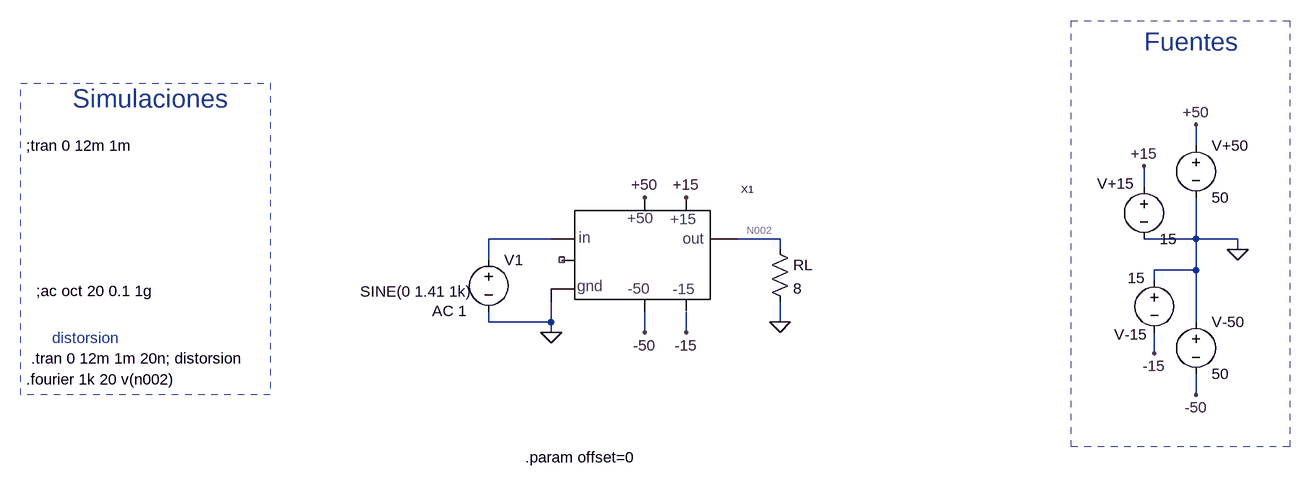
[diagram p0: schematic ampli-v2.asc]
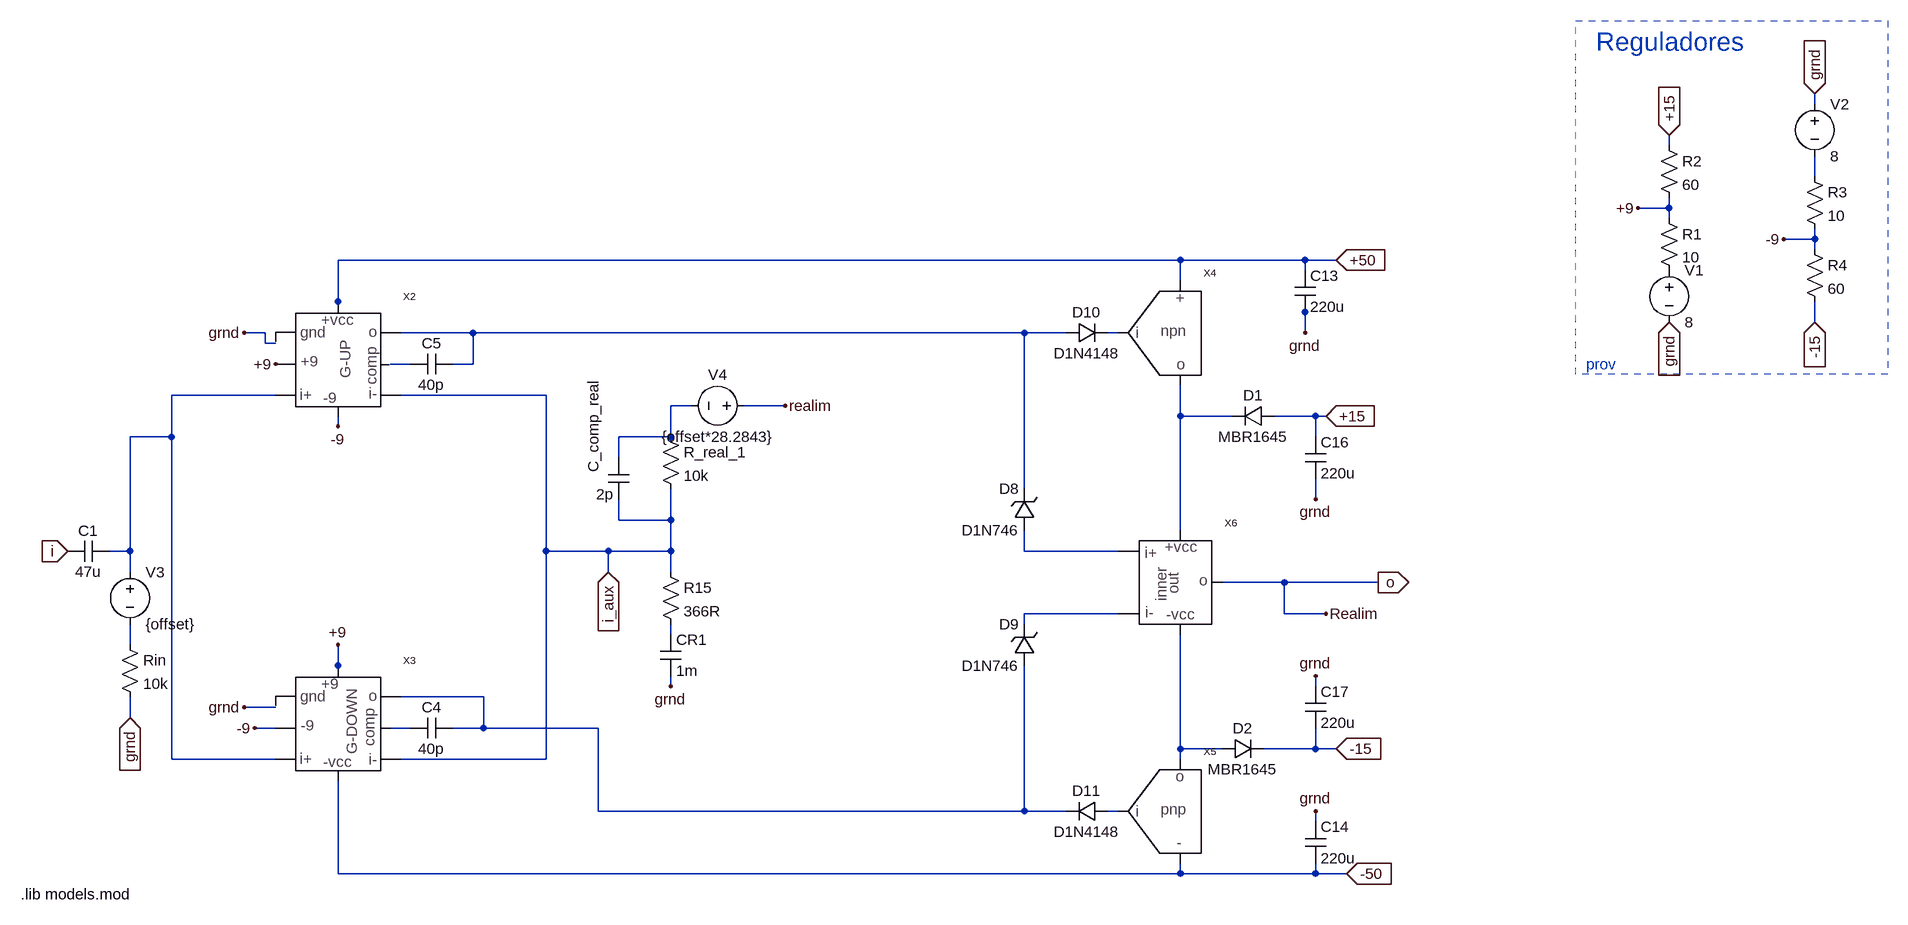
[diagram p1: sub-circuit ss-ampli-v2.asc]
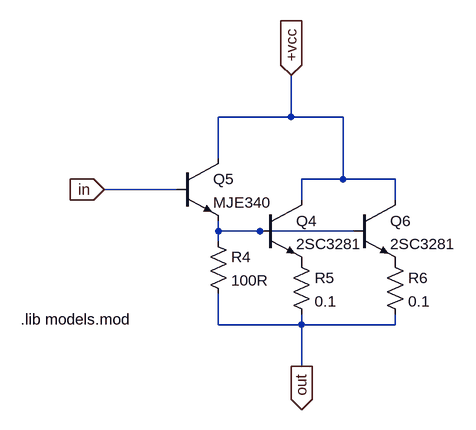
[diagram p2: sub-circuit ss-trans-out-npn.asc]
ampli-v2.asc, the LTspice schematic file:
Version 4
SHEET 1 1188 680
WIRE 1040 -32 1040 -64
WIRE 960 32 960 0
WIRE 48 112 -48 112
WIRE 400 112 336 112
WIRE 1040 112 1040 48
WIRE 1040 112 960 112
WIRE 1104 112 1040 112
WIRE 400 128 400 112
WIRE 1104 128 1104 112
WIRE -48 144 -48 112
WIRE 1040 160 1040 112
WIRE 1040 160 976 160
WIRE 976 176 976 160
WIRE -48 240 -48 224
WIRE 48 240 48 208
WIRE 48 240 -48 240
WIRE 400 240 400 208
WIRE 1040 240 1040 160
WIRE 48 256 48 240
WIRE 192 256 192 224
WIRE 256 256 256 224
WIRE 976 288 976 256
WIRE 1040 352 1040 320
FLAG 1104 128 0
FLAG 400 240 0
FLAG 1040 -64 +50
FLAG 960 0 +15
FLAG 976 288 -15
FLAG 1040 352 -50
FLAG 192 48 +50
FLAG 256 48 +15
FLAG 192 256 -50
FLAG 256 256 -15
FLAG 48 256 0
SYMBOL rui\\shortcuts\\voltage 976 160 R0
WINDOW 0 -62 99 Left 2
WINDOW 3 -41 12 Left 2
WINDOW 123 0 0 Left 2
WINDOW 39 0 0 Left 2
SYMATTR InstName V-15
SYMATTR Value 15
SYMBOL rui\\shortcuts\\voltage 1040 -48 R0
SYMATTR InstName V+50
SYMATTR Value 50
SYMBOL rui\\shortcuts\\voltage 960 16 R0
WINDOW 0 -72 11 Left 2
SYMATTR InstName V+15
SYMATTR Value 15
SYMBOL rui\\shortcuts\\voltage -48 128 R0
WINDOW 3 -198 65 Left 2
WINDOW 123 -87 95 Left 2
WINDOW 39 0 0 Left 2
SYMATTR Value SINE(0 1.41 1k)
SYMATTR Value2 AC 1
SYMATTR InstName V1
SYMBOL res 384 112 R0
SYMATTR InstName RL
SYMATTR Value 8
SYMBOL rui\\shortcuts\\voltage 1040 224 R0
SYMATTR InstName V-50
SYMATTR Value 50
SYMBOL ss-ampli-v2 192 128 R0
SYMATTR InstName X1
TEXT -760 -32 Left 2 !;tran 0 12m 1m
TEXT -760 328 Left 2 !.fourier 1k 20 v(n002)
TEXT 960 -192 Left 4 ;Fuentes
TEXT -688 -104 Left 4 ;Simulaciones
TEXT -752 296 Left 2 !.tran 0 12m 1m 20n; distorsion
TEXT -720 264 Left 2 ;distorsion
TEXT -744 192 Left 2 !;ac oct 20 0.1 1g
TEXT 8 448 Left 2 !.param offset=0
RECTANGLE Normal 1184 432 848 -224 2
RECTANGLE Normal -384 352 -768 -128 2

ss-ampli-v2.asc, the sub-circuit schematic file:
Version 4
SHEET 1 5420 680
WIRE 2896 -1552 2896 -1568
WIRE 2672 -1488 2672 -1504
WIRE 2896 -1440 2896 -1472
WIRE 2672 -1392 2672 -1408
WIRE 2672 -1392 2624 -1392
WIRE 2672 -1376 2672 -1392
WIRE 2896 -1344 2896 -1360
WIRE 2896 -1344 2848 -1344
WIRE 2896 -1328 2896 -1344
WIRE 1920 -1312 624 -1312
WIRE 2112 -1312 1920 -1312
WIRE 2160 -1312 2112 -1312
WIRE 2112 -1296 2112 -1312
WIRE 1920 -1280 1920 -1312
WIRE 624 -1248 624 -1312
WIRE 624 -1232 624 -1248
WIRE 2112 -1232 2112 -1248
WIRE 2896 -1216 2896 -1248
WIRE 512 -1200 480 -1200
WIRE 832 -1200 720 -1200
WIRE 1680 -1200 832 -1200
WIRE 1744 -1200 1680 -1200
WIRE 1824 -1200 1808 -1200
WIRE 2112 -1200 2112 -1232
WIRE 512 -1184 512 -1200
WIRE 528 -1184 512 -1184
WIRE 736 -1152 704 -1152
WIRE 832 -1152 832 -1200
WIRE 832 -1152 800 -1152
WIRE 528 -1104 368 -1104
WIRE 944 -1104 720 -1104
WIRE 1168 -1088 1136 -1088
WIRE 1312 -1088 1248 -1088
WIRE 1920 -1072 1920 -1120
WIRE 1936 -1072 1920 -1072
WIRE 2000 -1072 1936 -1072
WIRE 2096 -1072 2064 -1072
WIRE 2128 -1072 2096 -1072
WIRE 2144 -1072 2128 -1072
WIRE 624 -1056 624 -1072
WIRE 368 -1040 368 -1104
WIRE 368 -1040 304 -1040
WIRE 1136 -1040 1136 -1088
WIRE 1136 -1040 1056 -1040
WIRE 2128 -1040 2128 -1072
WIRE 1056 -1008 1056 -1040
WIRE 1680 -960 1680 -1200
WIRE 2128 -944 2128 -976
WIRE 1056 -912 1056 -944
WIRE 1136 -912 1136 -960
WIRE 1136 -912 1056 -912
WIRE 1920 -896 1920 -1072
WIRE 304 -864 304 -1040
WIRE 304 -864 272 -864
WIRE 944 -864 944 -1104
WIRE 1040 -864 944 -864
WIRE 1136 -864 1136 -912
WIRE 1136 -864 1040 -864
WIRE 1680 -864 1680 -896
WIRE 1824 -864 1680 -864
WIRE 304 -832 304 -864
WIRE 1040 -832 1040 -864
WIRE 1136 -832 1136 -864
WIRE 2080 -816 1984 -816
WIRE 2224 -816 2080 -816
WIRE 1824 -768 1680 -768
WIRE 2080 -768 2080 -816
WIRE 2144 -768 2080 -768
WIRE 1680 -752 1680 -768
WIRE 1136 -736 1136 -752
WIRE 304 -720 304 -752
WIRE 624 -688 624 -720
WIRE 624 -672 624 -688
WIRE 1136 -656 1136 -672
WIRE 2128 -656 2128 -672
WIRE 848 -640 720 -640
WIRE 528 -624 480 -624
WIRE 304 -608 304 -640
WIRE 528 -592 496 -592
WIRE 736 -592 704 -592
WIRE 848 -592 848 -640
WIRE 848 -592 800 -592
WIRE 1024 -592 848 -592
WIRE 1680 -576 1680 -688
WIRE 1920 -560 1920 -736
WIRE 1984 -560 1920 -560
WIRE 2080 -560 2048 -560
WIRE 2128 -560 2128 -592
WIRE 2128 -560 2080 -560
WIRE 2160 -560 2128 -560
WIRE 368 -544 368 -1040
WIRE 528 -544 368 -544
WIRE 944 -544 944 -864
WIRE 944 -544 720 -544
WIRE 1920 -544 1920 -560
WIRE 1024 -464 1024 -592
WIRE 1680 -464 1680 -576
WIRE 1680 -464 1024 -464
WIRE 1744 -464 1680 -464
WIRE 1824 -464 1808 -464
WIRE 2128 -448 2128 -464
WIRE 624 -368 624 -512
WIRE 1920 -368 1920 -384
WIRE 1920 -368 624 -368
WIRE 2128 -368 2128 -384
WIRE 2128 -368 1920 -368
WIRE 2176 -368 2128 -368
FLAG 2176 -368 -50
IOPIN 2176 -368 In
FLAG 2160 -560 -15
IOPIN 2160 -560 In
FLAG 2160 -1312 +50
IOPIN 2160 -1312 In
FLAG 2144 -1072 +15
IOPIN 2144 -1072 In
FLAG 1312 -1088 realim
FLAG 2144 -768 Realim
FLAG 208 -864 i
IOPIN 208 -864 In
FLAG 304 -608 grnd
IOPIN 304 -608 In
FLAG 2224 -816 o
IOPIN 2224 -816 Out
FLAG 1136 -656 grnd
FLAG 2128 -672 grnd
FLAG 2128 -944 grnd
FLAG 2112 -1200 grnd
FLAG 2128 -464 grnd
FLAG 1040 -832 i_aux
IOPIN 1040 -832 In
FLAG 624 -720 +9
FLAG 496 -592 -9
FLAG 624 -1056 -9
FLAG 528 -1152 +9
FLAG 2672 -1504 +15
IOPIN 2672 -1504 In
FLAG 2672 -1216 grnd
IOPIN 2672 -1216 In
FLAG 2624 -1392 +9
FLAG 2896 -1568 grnd
IOPIN 2896 -1568 In
FLAG 2848 -1344 -9
FLAG 2896 -1216 -15
IOPIN 2896 -1216 In
FLAG 480 -1200 grnd
FLAG 480 -624 grnd
DATAFLAG 1680 -576 "round($*100)/100"
DATAFLAG 2080 -816 "round($*10k)/10k"
DATAFLAG 2080 -560 "round($*100)/100"
DATAFLAG 2096 -1072 "round($*100)/100"
DATAFLAG 2096 -1072 "round($*100)/100"
DATAFLAG 2672 -1392 "round($*100)/100"
DATAFLAG 2896 -1344 "round($*100)/100"
DATAFLAG 1936 -1072 "round($*100)/100"
DATAFLAG 1936 -1072 "round($*100)/100"
SYMBOL diode 1744 -1184 R270
WINDOW 0 32 32 VTop 2
WINDOW 3 0 32 VBottom 2
SYMATTR InstName D10
SYMATTR Value D1N4148
SYMBOL zener 1696 -896 R180
WINDOW 0 24 64 Left 2
WINDOW 3 24 0 Left 2
SYMATTR InstName D8
SYMATTR Value D1N746
SYMBOL zener 1696 -688 R180
WINDOW 0 24 64 Left 2
WINDOW 3 24 0 Left 2
SYMATTR InstName D9
SYMATTR Value D1N746
SYMBOL diode 1808 -480 R90
WINDOW 0 0 32 VBottom 2
WINDOW 3 32 32 VTop 2
SYMATTR InstName D11
SYMATTR Value D1N4148
SYMBOL res 1120 -848 R0
SYMATTR InstName R15
SYMATTR Value 366R
SYMBOL res 1120 -1056 R0
SYMATTR InstName R_real_1
SYMATTR Value 10k
SYMBOL res 288 -736 R0
SYMATTR InstName Rin
SYMATTR Value 10k
SYMBOL cap 1120 -736 R0
SYMATTR InstName CR1
SYMATTR Value 1m
SYMBOL cap 272 -880 R90
WINDOW 0 0 32 VBottom 2
WINDOW 3 32 32 VTop 2
SYMATTR InstName C1
SYMATTR Value 47u
SYMBOL cap 2112 -448 R0
SYMATTR InstName C14
SYMATTR Value 220u
SYMBOL cap 2112 -1040 R0
SYMATTR InstName C16
SYMATTR Value 220u
SYMBOL cap 2112 -656 R0
SYMATTR InstName C17
SYMATTR Value 220u
SYMBOL cap 2096 -1296 R0
SYMATTR InstName C13
SYMATTR Value 220u
SYMBOL cap 1072 -944 R180
WINDOW 0 55 185 VLeft 2
WINDOW 3 24 8 Left 2
SYMATTR InstName C_comp_real
SYMATTR Value 2p
SYMBOL ss-trans-out-npn 1904 -1200 R0
SYMATTR InstName X4
SYMBOL ss-trans-out-pnp 1904 -464 R0
SYMATTR InstName X5
SYMBOL ss-inner-out 1920 -816 R0
SYMATTR InstName X6
SYMBOL rui\\shortcuts\\voltage 2672 -1312 R0
WINDOW 123 0 0 Left 2
WINDOW 39 0 0 Left 2
SYMATTR InstName V1
SYMATTR Value 8
SYMBOL res 2656 -1392 R0
SYMATTR InstName R1
SYMATTR Value 10
SYMBOL res 2656 -1504 R0
SYMATTR InstName R2
SYMATTR Value 60
SYMBOL rui\\shortcuts\\voltage 2896 -1568 R0
WINDOW 123 0 0 Left 2
WINDOW 39 0 0 Left 2
SYMATTR InstName V2
SYMATTR Value 8
SYMBOL res 2880 -1456 R0
SYMATTR InstName R3
SYMATTR Value 10
SYMBOL res 2880 -1344 R0
SYMATTR InstName R4
SYMATTR Value 60
SYMBOL ss-12+ 624 -1168 R0
SYMATTR InstName X2
SYMBOL ss-12- 624 -608 R0
SYMATTR InstName X3
SYMBOL rui\\shortcuts\\voltage 304 -848 R0
WINDOW 123 0 0 Left 2
WINDOW 39 0 0 Left 2
SYMATTR InstName V3
SYMATTR Value {offset}
SYMBOL rui\\shortcuts\\voltage 1264 -1088 R90
WINDOW 0 -32 56 VBottom 2
WINDOW 3 32 56 VTop 2
WINDOW 123 0 0 Left 2
WINDOW 39 0 0 Left 2
SYMATTR InstName V4
SYMATTR Value {offset*28.2843}
SYMBOL diode 2064 -1056 M270
WINDOW 0 32 32 VTop 2
WINDOW 3 0 32 VBottom 2
SYMATTR InstName D1
SYMATTR Value MBR1645
SYMBOL diode 1984 -544 R270
WINDOW 0 32 32 VTop 2
WINDOW 3 0 32 VBottom 2
SYMATTR InstName D2
SYMATTR Value MBR1645
SYMBOL cap 800 -608 R90
WINDOW 0 0 32 VBottom 2
WINDOW 3 32 32 VTop 2
SYMATTR InstName C4
SYMATTR Value 40p
SYMBOL cap 800 -1168 R90
WINDOW 0 0 32 VBottom 2
WINDOW 3 32 32 VTop 2
SYMATTR InstName C5
SYMATTR Value 40p
TEXT 136 -336 Left 2 !.lib models.mod
TEXT 2560 -1648 Left 4 ;Reguladores
TEXT 2544 -1152 Left 2 ;prov
RECTANGLE Normal 3008 -1136 2528 -1680 2

ss-trans-out-npn.asc, the sub-circuit schematic file:
Version 4
SHEET 1 880 680
WIRE 208 -64 208 -128
WIRE 208 -64 96 -64
WIRE 288 -64 208 -64
WIRE 96 0 96 -64
WIRE 288 32 288 -64
WIRE 288 32 224 32
WIRE 368 32 288 32
WIRE 32 48 -80 48
WIRE 224 64 224 32
WIRE 368 64 368 32
WIRE 96 112 96 96
WIRE 160 112 96 112
WIRE 304 112 160 112
WIRE 96 128 96 112
WIRE 96 256 96 208
WIRE 224 256 224 240
WIRE 224 256 96 256
WIRE 320 256 224 256
WIRE 368 256 368 240
WIRE 368 256 320 256
WIRE 224 320 224 256
FLAG -80 48 in
IOPIN -80 48 In
FLAG 208 -128 +vcc
IOPIN 208 -128 In
FLAG 224 320 out
IOPIN 224 320 Out
DATAFLAG 320 256 "round($*100)/100"
DATAFLAG 320 256 "round($*100)/100"
SYMBOL npn 160 64 R0
SYMATTR InstName Q4
SYMATTR Value 2SC3281
SYMBOL npn 32 0 R0
SYMATTR InstName Q5
SYMATTR Value MJE340
SYMBOL res 80 112 R0
SYMATTR InstName R4
SYMATTR Value 100R
SYMBOL npn 304 64 R0
SYMATTR InstName Q6
SYMATTR Value 2SC3281
SYMBOL res 208 144 R0
SYMATTR InstName R5
SYMATTR Value 0.1
SYMBOL res 352 144 R0
SYMATTR InstName R6
SYMATTR Value 0.1
TEXT -208 248 Left 2 !.lib models.mod

The netlist it stands for:
* ampli-v2.asc
V-15 0 -15 15
V+50 +50 0 50
V+15 +15 0 15
V1 N001 0 SINE(0 1.41 1k) AC 1
RL N002 0 8
V-50 0 -50 50
XX1 0 N001 N002 +50 -50 +15 -15 NC_01 ss-ampli-v2

* block symbol definitions
.subckt ss-ampli-v2 grnd i o +50 -50 +15 -15 i_aux
D10 N002 N003 D1N4148
D8 N008 N002 D1N746
D9 N012 N009 D1N746
D11 N015 N012 D1N4148
R15 i_aux N010 366R
R_real_1 N006 i_aux 10k
Rin N011 grnd 10k
CR1 N010 grnd 1m
C1 N005 i 47u
C14 grnd -50 220u
C16 +15 grnd 220u
C17 grnd -15 220u
C13 +50 grnd 220u
C_comp_real i_aux N006 2p
XX4 N003 +50 N007 ss-trans-out-npn
XX5 N015 N014 -50 ss-trans-out-pnp  ; pins in out -vcc
XX6 N007 N014 o N008 N009 ss-inner-out  ; pins +15 -15 o i+ i-
V1 P001 grnd 8
R1 +9 P001 10
R2 +15 +9 60
V2 grnd N001 8
R3 N001 -9 10
R4 -9 -15 60
XX2 N005 i_aux N002 +50 -9 grnd +9 N004 ss-12+ rc=20k  ; pins i+ i- o +vcc -9 grnd +9 comp
XX3 N005 i_aux N012 +9 -50 grnd -9 N013 ss-12- rc=20k  ; pins i+ i- o +9 -vcc grnd -9 comp
V3 N005 N011 {offset}
V4 o N006 {offset*28.2843}
D1 +15 N007 MBR1645
D2 N014 -15 MBR1645
C4 N012 N013 40p
C5 N002 N004 40p
.lib models.mod
* Reguladores
* prov
.ends ss-ampli-v2

.subckt ss-trans-out-npn in +vcc out
Q4 +vcc N001 P001 0 2SC3281
Q5 +vcc in N001 0 MJE340
R4 N001 out 100R
Q6 +vcc N001 P002 0 2SC3281
R5 P001 out 0.1
R6 P002 out 0.1
.lib models.mod
.ends ss-trans-out-npn

.model D D
.lib standard.dio
.model NPN NPN
.model PNP PNP
.lib standard.bjt
;tran 0 12m 1m
.fourier 1k 20 v(n002)
* Fuentes
* Simulaciones
.tran 0 12m 1m 20n; distorsion
* distorsion
;ac oct 20 0.1 1g
.param offset=0
.backanno
.end